# Altium schematic sheet SCH_V1.SchDoc: Mike
size A3; CompanyName: Exeger AB; Organization: Exeger AB; Address1: Brinellvägen 32; Address3: 114 28 Stockholm; Address4: SWEDEN; Revision: 0.1; SheetNumber: 1; SheetTotal: 1; PageSetup: Record=PageOptions|CenterHorizontal=True|CenterVertical=True|PrintScale=1.01|XCorrection=1.00|YCorrection=1.00|PrintKind=2|BorderSize=5000000|LeftOffset=0|BottomOffset=0|Orientation=2|PaperLength=1000|PaperWidth=1000|Scale=100|PaperSource=7|PrintQuality=-3|MediaType=1|DitherType=10|PrintScaleMode=1|PaperKind=A3|PaperIndex=8
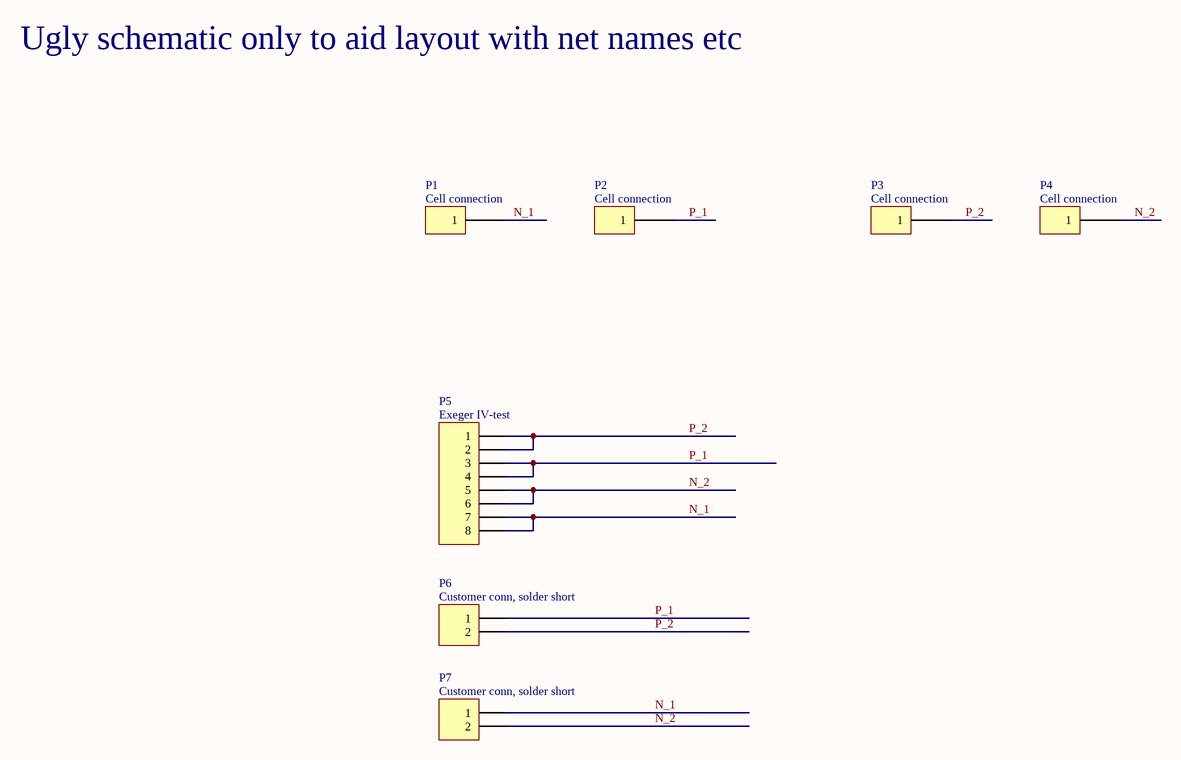
[diagram p0: SCH_V1.SchDoc]

## Parts
P1  Cell connection  [Cell_pad_4mm_SM0.5mm]
P2  Cell connection  [Cell_pad_4mm_SM0.5mm]
P3  Cell connection  [Cell_pad_4mm_SM0.5mm]
P4  Cell connection  [Cell_pad_4mm_SM0.5mm]
P5  Exeger IV-test  [EXEGER_IV_8_PIN_NO_STIFF_ISOL_0.4]
P6  Customer conn, solder short  [Customer_2022_solder_short_ISOL_0.4_S]
P7  Customer conn, solder short  [Customer_2022_solder_short_ISOL_0.4_S]

## Nets
N_1: P1.1 P5.7 P5.8 P7.1
N_2: P4.1 P5.5 P5.6 P7.2
P_1: P2.1 P5.3 P5.4 P6.1
P_2: P3.1 P5.1 P5.2 P6.2

## Notes on the sheet
- Ugly schematic only to aid layout with net names etc
- Project Title
- DRAWN BY
- REVISION DATE
- PART NUMBER
- CHECKED BY
- Page Description
- SIZE
- A3
- SHEET
- /
- REV

## Library data of the parts
P1-P4 = Cell connection 1P
P5 = Header 8: Header, 8-Pin
P6 P7 = Header 2: Header, 2-Pin